# Altium project Scales.PrjPcb
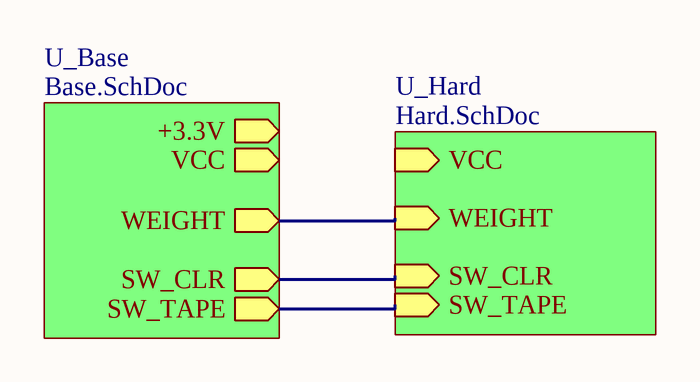
[diagram p0: MainScales.SchDoc]
4 sheets, 113 parts. Net scope: hierarchical (ports join the sheet entries above them; power ports are global).
Board file: Scales.PcbDoc
Sheets:
  MainScales.SchDoc
    U_Base = Base.SchDoc
    U_Hard = Hard.SchDoc
  Soft.SchDoc

## Sheet MainScales.SchDoc
size 297 x 209 mm; SheetNumber: 2; SheetTotal: 3

### Sub-sheets
U_Base = Base.SchDoc: SW_TAPE (out), SW_CLR (out), +3.3V (out), WEIGHT (out), VCC (out)
U_Hard = Hard.SchDoc: WEIGHT (in), VCC (in), SW_CLR (in), SW_TAPE (in)

### Nets
VCC: sheet U_Base/VCC, sheet U_Hard/VCC
NetC16_2: sheet U_Base/SW_TAPE, sheet U_Hard/SW_TAPE
NetD5_10: sheet U_Base/SW_CLR, sheet U_Hard/SW_CLR
NetD13_6: sheet U_Base/WEIGHT, sheet U_Hard/WEIGHT

### Notes on the sheet
- Author
- Manufacturer
- Date
- Page
- Total pages
- Size page
- A4
- Materials

## Sheet Base.SchDoc
size 420 x 297 mm; SheetNumber: 2; SheetTotal: 4
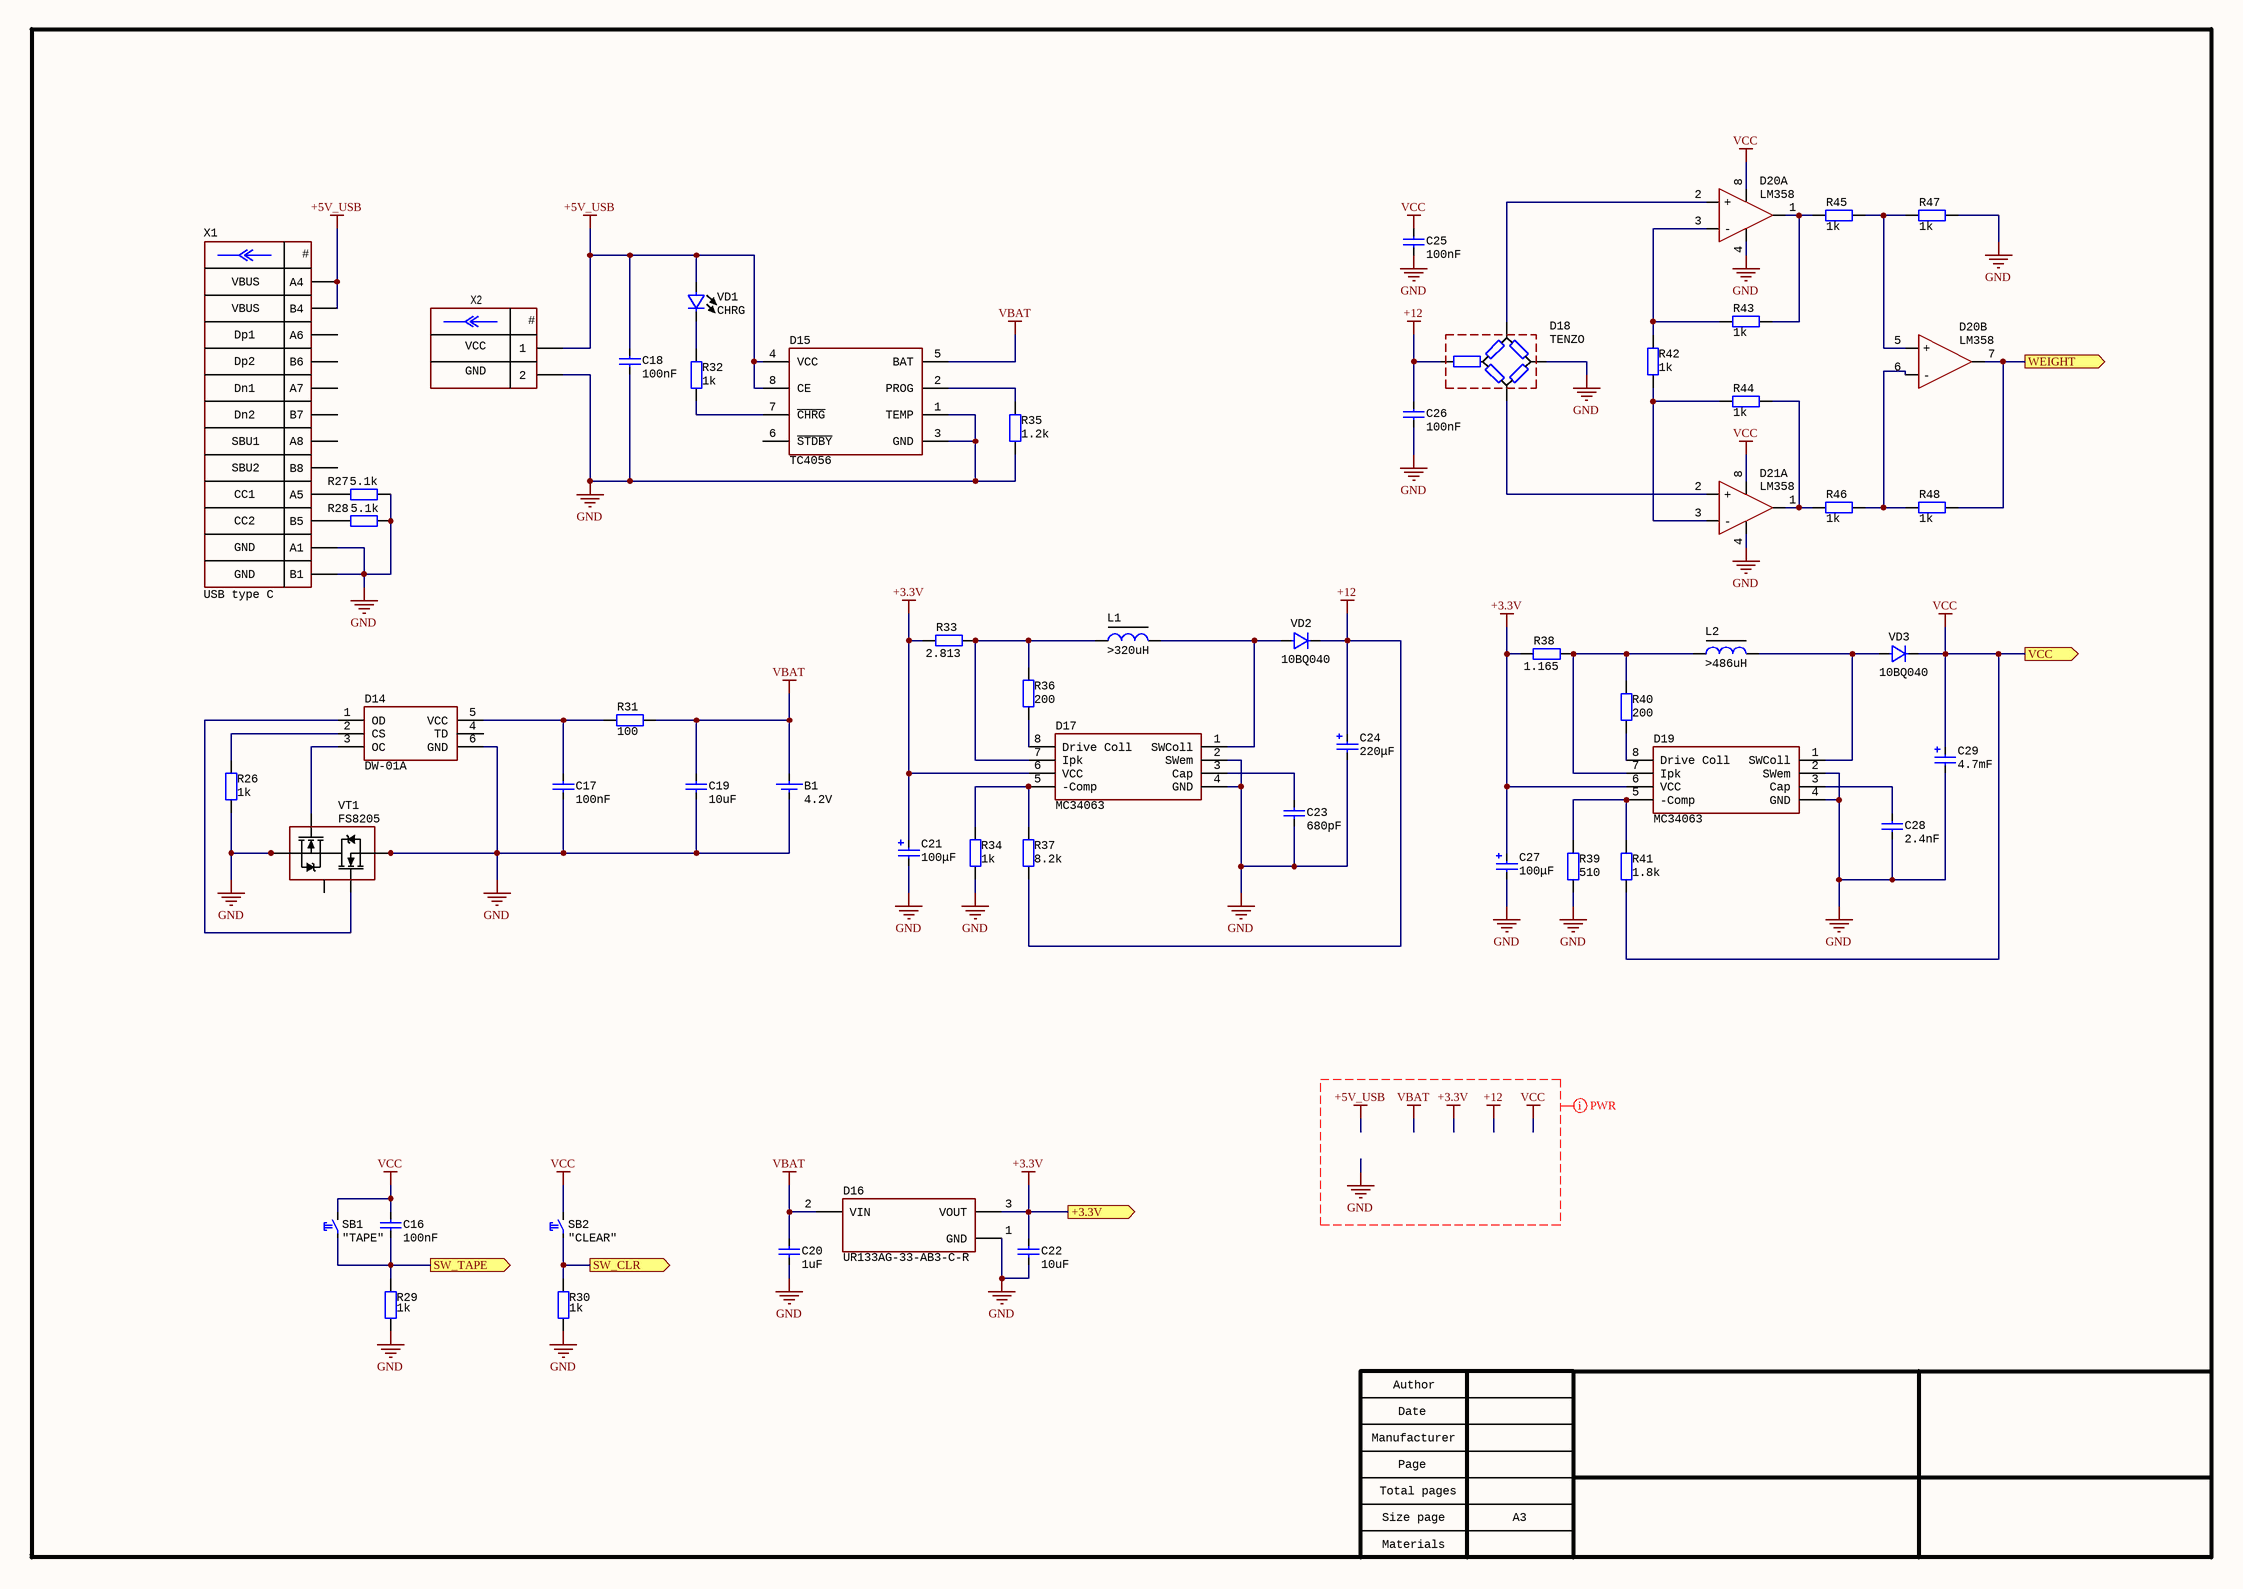
[diagram p1: Base.SchDoc]

### Parts
B1  VoltageMax: 4.2V  [CON: PLS-2]
C16  value 100nF  [CAP: ECHU(X) K (0603)]
C17  value 100nF  [CAP: ECHU(X) K (0603)]
C18  value 100nF  [CAP: ECHU(X) K (0603)]
C19  value 10uF  [CAP: ECHU(X) K (0603)]
C20  value 1uF  [CAP: ECHU(X) K (0603)]
C21  value 100μF  [CAP: TANTAL-E]
C22  value 10uF  [CAP: ECHU(X) K (0603)]
C23  value 680pF  [CAP: ECHU(X) J (0805)]
C24  value 220μF  [CAP: TANTAL-E]
C25  value 100nF  [CAP: ECHU(X) K (0603)]
C26  value 100nF  [CAP: ECHU(X) K (0603)]
C27  value 100μF  [CAP: TANTAL-E]
C28  value 2.4nF  [CAP: ECHU(X) J (0805)]
C29  value 4.7mF  [CAP: TANTAL-E]
D14  DW-01A  [SOT23-6]
D15  TC4056  [8-SOIC]
D16  (no value)  [SOT-89]
D17  (no value)  [8-SOIC]
D18  TENZO  [CON: PLS-4]
D19  (no value)  [8-SOIC]
D20  LM358  [8-SOIC]  (parts A,B of 2)
D21  LM358  [8-SOIC]  (part A of 2)
L1  Voltage: >320uH  [LQH55]
L2  Voltage: >486uH  [LQH55]
R26  value 1k  [RES: 0402]
R27  value 5.1k  [RES: 0402]
R28  value 5.1k  [RES: 0402]
R29  value 1k  [RES: 0402]
R30  value 1k  [RES: 0402]
R31  value 100  [RES: 0402]
R32  value 1k  [RES: 0402]
R33  value 2.813  [RES: 0402]
R34  value 1k  [RES: 0402]
R35  value 1.2k  [RES: 0402]
R36  value 200  [RES: 0402]
R37  value 8.2k  [RES: 0402]
R38  value 1.165  [RES: 0402]
R39  value 510  [RES: 0402]
R40  value 200  [RES: 0402]
R41  value 1.8k  [RES: 0402]
R42  value 1k  [RES: 0402]
R43  value 1k  [RES: 0402]
R44  value 1k  [RES: 0402]
R45  value 1k  [RES: 0402]
R46  value 1k  [RES: 0402]
R47  value 1k  [RES: 0402]
R48  value 1k  [RES: 0402]
SB1  CommentText: "TAPE"  [BUT: 6x3.5 SMD]
SB2  CommentText: "CLEAR"  [BUT: 6x3.5 SMD]
VD1  Color: CHRG  [LED: 0402B]
VD2  PartNumber: 10BQ040  [DIODE: SMB]
VD3  PartNumber: 10BQ040  [DIODE: SMB]
VT1  (no value)  [8-TSOP]
X1  CommentText: USB type C  [CON: TYPE-C-31-M-12]
X2  (no value)  [CON: PLS-2]

### Ports
+3.3V (out), SW_CLR (out), SW_TAPE (out), VCC (out), WEIGHT (out)

### Nets
+3.3V: C21.1 C22.2 C27.1 D16.3(VOUT) D17.6(VCC) D19.6(VCC) R33.1 R38.1 ; port +3.3V
+5V_USB: C18.2 D15.4(VCC) D15.8(CE) VD1.1 X1.A4 X1.B4 X2.1
+12: C24.1 C26.2 D18.1 R37.2 VD2.2
GND: B1.2(-) C17.1 C18.1 C19.2 C20.1 C21.2 C22.1 C23.1 C24.2 C25.1 C26.1 C27.2 C28.1 C29.2 D14.6(GND) D15.1(TEMP) D15.3(GND) D16.1(GND) D17.2(SWem) D17.4(GND) D18.4 D19.2(SWem) D19.4(GND) D20.4 D21.4 R26.2 R27.2 R28.2 R29.1 R30.1 R34.2 R35.2 R39.2 R47.1 VT1.2(S1) VT1.3(S1) VT1.6(S2) VT1.7(S2) X1.A1 X1.B1 X2.2
VBAT: B1.1(+) C19.1 C20.2 D15.5(BAT) D16.2(VIN) R31.2
VCC: C16.1 C25.2 C29.1 D20.8 D21.8 R41.2 SB1.2 SB2.2 VD3.2 ; port VCC
NetC16_2: C16.2 R29.2 SB1.1 ; port SW_TAPE
NetC17_2: C17.2 D14.5(VCC) R31.1
NetC23_2: C23.2 D17.3(Cap)
NetC28_2: C28.2 D19.3(Cap)
NetD5_10: R30.2 SB2.1 ; port SW_CLR
NetD13_6: D20.7 R48.1 ; port WEIGHT
NetD14_1: D14.1(OD) VT1.5(G2)
NetD14_2: D14.2(CS) R26.1
NetD14_3: D14.3(OC) VT1.4(G1)
NetD15_2: D15.2(PROG) R35.1
NetD15_7: D15.7(~{CHRG}) R32.2
NetD17_1: D17.1(SWColl) L1.1 VD2.1
NetD17_5: D17.5(-Comp) R34.1 R37.1
NetD17_7: D17.7(Ipk) L1.2 R33.2 R36.1
NetD17_8: D17.8(Drive_Coll) R36.2
NetD18_2: D18.2 D20.2(+)
NetD18_3: D18.3 D21.2(+)
NetD19_1: D19.1(SWColl) L2.1 VD3.1
NetD19_5: D19.5(-Comp) R39.1 R41.1
NetD19_7: D19.7(Ipk) L2.2 R38.2 R40.1
NetD19_8: D19.8(Drive_Coll) R40.2
NetD20_1: D20.1 R43.2 R45.2
NetD20_3: D20.3(-) R42.1 R43.1
NetD20_5: D20.5(+) R45.1 R47.2
NetD20_6: D20.6(-) R46.1 R48.2
NetD21_1: D21.1 R44.2 R46.2
NetD21_3: D21.3(-) R42.2 R44.1
NetR27_1: R27.1 X1.A5
NetR28_1: R28.1 X1.B5
NetR32_1: R32.1 VD1.2
NetVT1_1: VT1.1(D12) VT1.8(D12)

Not connected (* = marked no-connect by the designer): D14 4(TD); D15 6(~{STDBY}); X1 A6 A7 A8 B6 B7 B8

### Layout directives
net class PWR: +3.3V, +5V_USB, +12, GND, VBAT, VCC

### Notes on the sheet
- VCC
- (near X2) GND
- Author
- Manufacturer
- Date
- Page
- Total pages
- Size page
- A3
- Materials
- (in symbol Connector_USB_Type_C) #; VBUS; Dp1; Dp2; Dn1; Dn2; SBU1; SBU2; CC1; CC2; GND
- (in symbol PLS-2) #

### Library data of the parts
B1 = Battery PLS-2: Manufacturer: ALLOYSEED; ValueManufacturerPartNumber: Single holder 18650, 4.2V; PartNumber: Holder 18650; TypeConnector: Single holder 18650; HelpURL: https://ru.aliexpress.com/item/32814062027.html?spm=2114.13010708.0.0.498333edwmS6ak
C16-C18 C25 C26 = Film: Manufacturer: Epcos; PartNumber: B32774D4106K000; ValueManufacturerPartNumber: Film capacitor, 100nF, 15VDC, ±10%, 10.9mOhm, 31.5x15 mm, -40...+105°C; TypeCapacitor: Film capacitor; Tolerance: ±10%; Impedance: 10.9mOhm; Voltage: 15VDC; Package: 31.5x15 mm; HelpURL: https://www.digikey.com/products/en/capacitors/film-capacitors/62?k=&pkeyword=&sv=0&pv2097=1958&sf=0&FV=fffc01ef%2C1f140000%2Cffe0003e%2Cffec6366&quantity=1&ColumnSort=1000011&page=1&stock=1&pageSize=25; Temperature: -40...+105°C
C19 C22 = Film: Manufacturer: Epcos; PartNumber: B32774D4106K000; ValueManufacturerPartNumber: Film capacitor, 10uF, 15VDC, ±10%, 10.9mOhm, 31.5x15 mm, -40...+105°C; TypeCapacitor: Film capacitor; Tolerance: ±10%; Impedance: 10.9mOhm; Voltage: 15VDC; Package: 31.5x15 mm; HelpURL: https://www.digikey.com/products/en/capacitors/film-capacitors/62?k=&pkeyword=&sv=0&pv2097=1958&sf=0&FV=fffc01ef%2C1f140000%2Cffe0003e%2Cffec6366&quantity=1&ColumnSort=1000011&page=1&stock=1&pageSize=25; Temperature: -40...+105°C
C20 = Film: Manufacturer: Epcos; PartNumber: B32774D4106K000; ValueManufacturerPartNumber: Film capacitor, 1uF, 15VDC, ±10%, 10.9mOhm, 31.5x15 mm, -40...+105°C; TypeCapacitor: Film capacitor; Tolerance: ±10%; Impedance: 10.9mOhm; Voltage: 15VDC; Package: 31.5x15 mm; HelpURL: https://www.digikey.com/products/en/capacitors/film-capacitors/62?k=&pkeyword=&sv=0&pv2097=1958&sf=0&FV=fffc01ef%2C1f140000%2Cffe0003e%2Cffec6366&quantity=1&ColumnSort=1000011&page=1&stock=1&pageSize=25; Temperature: -40...+105°C
C21 C27 = Tantal: Manufacturer: AVX; PartNumber: F930J107KAAAJ6; ValueManufacturerPartNumber: Tantalum capacitor, 100μF, 6.3V, ±10%, 2Ohm, case A (3216), -55...+125°C; Impedance: 2Ohm; Tolerance: ±10%; TypeDielectric: X7R; TypeCapacitor: Tantalum capacitor; Voltage: 6.3V; Package: case A (3216); HelpURL: https://www.digikey.com/product-detail/en/avx-corporation/F930J107KAAAJ6/478-12404-1-ND/9645231; Temperature: -55...+125°C
C23 = Film: Manufacturer: Epcos; PartNumber: B32774D4106K000; ValueManufacturerPartNumber: Film capacitor, 680pF, 15VDC, ±10%, 10.9mOhm, 31.5x15 mm, -40...+105°C; TypeCapacitor: Film capacitor; Tolerance: ±10%; Impedance: 10.9mOhm; Voltage: 15VDC; Package: 31.5x15 mm; HelpURL: https://www.digikey.com/products/en/capacitors/film-capacitors/62?k=&pkeyword=&sv=0&pv2097=1958&sf=0&FV=fffc01ef%2C1f140000%2Cffe0003e%2Cffec6366&quantity=1&ColumnSort=1000011&page=1&stock=1&pageSize=25; Temperature: -40...+105°C
C24 = Tantal: Manufacturer: AVX; PartNumber: F930J107KAAAJ6; ValueManufacturerPartNumber: Tantalum capacitor, 220μF, 6.3V, ±10%, 2Ohm, case A (3216), -55...+125°C; Impedance: 2Ohm; Tolerance: ±10%; TypeDielectric: X7R; TypeCapacitor: Tantalum capacitor; Voltage: 6.3V; Package: case A (3216); HelpURL: https://www.digikey.com/product-detail/en/avx-corporation/F930J107KAAAJ6/478-12404-1-ND/9645231; Temperature: -55...+125°C
C28 = Film: Manufacturer: Epcos; PartNumber: B32774D4106K000; ValueManufacturerPartNumber: Film capacitor, 2.4nF, 15VDC, ±10%, 10.9mOhm, 31.5x15 mm, -40...+105°C; TypeCapacitor: Film capacitor; Tolerance: ±10%; Impedance: 10.9mOhm; Voltage: 15VDC; Package: 31.5x15 mm; HelpURL: https://www.digikey.com/products/en/capacitors/film-capacitors/62?k=&pkeyword=&sv=0&pv2097=1958&sf=0&FV=fffc01ef%2C1f140000%2Cffe0003e%2Cffec6366&quantity=1&ColumnSort=1000011&page=1&stock=1&pageSize=25; Temperature: -40...+105°C
C29 = Tantal: Manufacturer: AVX; PartNumber: F930J107KAAAJ6; ValueManufacturerPartNumber: Tantalum capacitor, 4.7mF, 6.3V, ±10%, 2Ohm, case A (3216), -55...+125°C; Impedance: 2Ohm; Tolerance: ±10%; TypeDielectric: X7R; TypeCapacitor: Tantalum capacitor; Voltage: 6.3V; Package: case A (3216); HelpURL: https://www.digikey.com/product-detail/en/avx-corporation/F930J107KAAAJ6/478-12404-1-ND/9645231; Temperature: -55...+125°C
D14 = DW-01A: No Charging Interruption Due to Input Voltage Fluctuation, 4.5 to 6.5 V Vin, 8-pin SOT23 (TS8-8), -40 to 85 degC, Pb-Free, Mini Tape and Reel; PartNumber: LTC4056ETS8-4.2#TRMPBF; Manufacturer: Linear Technology; Max Charge Current(A): 0.7; Vin Max(V): 6.5; Battery Chemistry: Li-Ion, Li-Polymer; Number of Cells: 1; Charge Termination: On-board timer; Float Voltage: 4.2 V; Type of Charger: Linear; Vin Min(V): 4.5; Mounting Technology: Surface Mount; PackageVersion: Rev. A, 08/2010; ComponentLink3Description: Package Specification; Packing: Mini Tape and Reel; PackageReference: TS8-8; ComponentLink2URL: http://cds.linear.com/docs/en/datasheet/405642f.pdf; PackageDescription: 8-Pin Plastic TSOT-23, Body 2.9 x 1.63 mm, Pitch 0.65 mm; ComponentLink2Description: Datasheet; Code_JEDEC: MO-193; ComponentLink3URL: http://cds.linear.com/docs/en/packaging/SOT_8_05-08-1637.pdf; ComponentLink1Description: Manufacturer URL; ComponentLink1URL: http://www.linear.com/; RoHS: TRUE
D15 = TC4056: No Charging Interruption Due to Input Voltage Fluctuation, 4.5 to 6.5 V Vin, 8-pin SOT23 (TS8-8), -40 to 85 degC, Pb-Free, Mini Tape and Reel; PartNumber: LTC4056ETS8-4.2#TRMPBF; Manufacturer: Linear Technology; Max Charge Current(A): 0.7; Vin Max(V): 6.5; Battery Chemistry: Li-Ion, Li-Polymer; Number of Cells: 1; Charge Termination: On-board timer; Float Voltage: 4.2 V; Type of Charger: Linear; Vin Min(V): 4.5; Mounting Technology: Surface Mount; PackageVersion: Rev. A, 08/2010; ComponentLink3Description: Package Specification; Packing: Mini Tape and Reel; PackageReference: TS8-8; ComponentLink2URL: http://cds.linear.com/docs/en/datasheet/405642f.pdf; PackageDescription: 8-Pin Plastic TSOT-23, Body 2.9 x 1.63 mm, Pitch 0.65 mm; ComponentLink2Description: Datasheet; Code_JEDEC: MO-193; ComponentLink3URL: http://cds.linear.com/docs/en/packaging/SOT_8_05-08-1637.pdf; ComponentLink1Description: Manufacturer URL; ComponentLink1URL: http://www.linear.com/; RoHS: TRUE
D16 = UR133AG-33-AB3-C-R: Linear voltage regulator; Manufacturer: Diodes Incorporated; ValueManufacturerPartNumber: Linear voltage regulator, input 2.5...6V, 0.7V, output 1.8V, 0.3A, -40...+85°C, SOT23-5; VoltageInput: input 2.5...6V; MaxDropout: 0.7V; CurrentOutput: 0.3A; VoltageOutput: output 1.8V; HelpURL: https://www.digikey.com/en/products/detail/diodes-incorporated/AP2127K-1-8TRG1/4470784; Package: SOT23-5; ComponentType: Linear voltage regulator; Temperature: -40...+85°C; PartNumber: UR133AG-33-AB3-C-R
D17 D19 = MC34063: DC/DC; Manufacturer: Diodes Incorporated; ValueManufacturerPartNumber: DC/DC boost converter, input 2.6...16V, 1.5MHz, output 3...29V, 0.5A, -40...+85°C, SOT23-5; VoltageInput: input 2.6...16V; Frequency: 1.5MHz; CurrentOutput: 0.5A; VoltageOutput: output 3...29V; HelpURL: https://www.digikey.com/product-detail/en/diodes-incorporated/AP3012KTR-G1/AP3012KTR-G1DICT-ND/4505297; Package: SOT23-5; ComponentType: DC/DC boost converter; Temperature: -40...+85°C; PartNumber: MC34063
D20 D21 = LM358: Comparator; Manufacturer: Microchip Technology; ValueManufacturerPartNumber: IC comparator, Rail-to-Rail, 1.6...5.5V, -40...+85°C, SOT23-5; Supply: 1.6...5.5V; OutputType: Rail-to-Rail; HelpURL: https://www.digikey.com/product-detail/en/microchip-technology/MCP6541T-I-OT/MCP6541T-I-OTCT-ND/3622387; Package: SOT23-5; ComponentType: IC comparator; Temperature: -40...+85°C
L1 = Current_CT1005A: Manufacturer: Asia; ValueManufacturerPartNumber: Transformer, >320uH, 0...250 Ohm; PartNumber: DL-CT1005A; TypeTransformer: Transformer; Power: 0...250 Ohm; HelpURL: https://ru.aliexpress.com/item/32848841435.html?spm=a2g0v.search0104.3.2.64104769Wp7Ww8&ws_ab_test=searchweb0_0%2Csearchweb201602_10_10065_10068_319_317_10696_453_10084_454_10083_10618_10307_10301_537_536_10059_10884_10887_321_322_10915_10103_10914_10911_10910%2Csearchweb201603_52%2CppcSwitch_0&algo_expid=7e4b162f-38ca-419c-8891-4e3cfaf6b6a7-0&algo_pvid=7e4b162f-38ca-419c-8891-4e3cfaf6b6a7&transAbTest=ae803_5
L2 = Current_CT1005A: Manufacturer: Asia; ValueManufacturerPartNumber: Transformer, >486uH, 0...250 Ohm; PartNumber: DL-CT1005A; TypeTransformer: Transformer; Power: 0...250 Ohm; HelpURL: https://ru.aliexpress.com/item/32848841435.html?spm=a2g0v.search0104.3.2.64104769Wp7Ww8&ws_ab_test=searchweb0_0%2Csearchweb201602_10_10065_10068_319_317_10696_453_10084_454_10083_10618_10307_10301_537_536_10059_10884_10887_321_322_10915_10103_10914_10911_10910%2Csearchweb201603_52%2CppcSwitch_0&algo_expid=7e4b162f-38ca-419c-8891-4e3cfaf6b6a7-0&algo_pvid=7e4b162f-38ca-419c-8891-4e3cfaf6b6a7&transAbTest=ae803_5
R26 R29 R30 R32 R34 R42-R48 = Resistor_2: Manufacturer: Yageo; PartNumber: RC0201JR-07100RL; ValueManufacturerPartNumber: Resistor film, 1k, ±5%, 0201, 0.05W, -55...+125°C; TypeResistor: Resistor film; Power: 0.05W; Tolerance: ±5%; Package: 0201; HelpURL: https://www.digikey.com/product-detail/en/yageo/RC0201JR-07100RL/311-100NCT-ND/1949006; Temperature: -55...+125°C
R27 R28 = Resistor_2: Manufacturer: Yageo; PartNumber: RC0201JR-07100RL; ValueManufacturerPartNumber: Resistor film, 5.1k, ±5%, 0201, 0.05W, -55...+125°C; TypeResistor: Resistor film; Power: 0.05W; Tolerance: ±5%; Package: 0201; HelpURL: https://www.digikey.com/product-detail/en/yageo/RC0201JR-07100RL/311-100NCT-ND/1949006; Temperature: -55...+125°C
R31 = Resistor_2: Manufacturer: Yageo; PartNumber: RC0201JR-07100RL; ValueManufacturerPartNumber: Resistor film, 100, ±5%, 0201, 0.05W, -55...+125°C; TypeResistor: Resistor film; Power: 0.05W; Tolerance: ±5%; Package: 0201; HelpURL: https://www.digikey.com/product-detail/en/yageo/RC0201JR-07100RL/311-100NCT-ND/1949006; Temperature: -55...+125°C
R33 = Resistor_2: Manufacturer: Yageo; PartNumber: RC0201JR-07100RL; ValueManufacturerPartNumber: Resistor film, 2.813, ±5%, 0201, 0.05W, -55...+125°C; TypeResistor: Resistor film; Power: 0.05W; Tolerance: ±5%; Package: 0201; HelpURL: https://www.digikey.com/product-detail/en/yageo/RC0201JR-07100RL/311-100NCT-ND/1949006; Temperature: -55...+125°C
R35 = Resistor_2: Manufacturer: Yageo; PartNumber: RC0201JR-07100RL; ValueManufacturerPartNumber: Resistor film, 1.2k, ±5%, 0201, 0.05W, -55...+125°C; TypeResistor: Resistor film; Power: 0.05W; Tolerance: ±5%; Package: 0201; HelpURL: https://www.digikey.com/product-detail/en/yageo/RC0201JR-07100RL/311-100NCT-ND/1949006; Temperature: -55...+125°C
R36 R40 = Resistor_2: Manufacturer: Yageo; PartNumber: RC0201JR-07100RL; ValueManufacturerPartNumber: Resistor film, 200, ±5%, 0201, 0.05W, -55...+125°C; TypeResistor: Resistor film; Power: 0.05W; Tolerance: ±5%; Package: 0201; HelpURL: https://www.digikey.com/product-detail/en/yageo/RC0201JR-07100RL/311-100NCT-ND/1949006; Temperature: -55...+125°C
R37 = Resistor_2: Manufacturer: Yageo; PartNumber: RC0201JR-07100RL; ValueManufacturerPartNumber: Resistor film, 8.2k, ±5%, 0201, 0.05W, -55...+125°C; TypeResistor: Resistor film; Power: 0.05W; Tolerance: ±5%; Package: 0201; HelpURL: https://www.digikey.com/product-detail/en/yageo/RC0201JR-07100RL/311-100NCT-ND/1949006; Temperature: -55...+125°C
R38 = Resistor_2: Manufacturer: Yageo; PartNumber: RC0201JR-07100RL; ValueManufacturerPartNumber: Resistor film, 1.165, ±5%, 0201, 0.05W, -55...+125°C; TypeResistor: Resistor film; Power: 0.05W; Tolerance: ±5%; Package: 0201; HelpURL: https://www.digikey.com/product-detail/en/yageo/RC0201JR-07100RL/311-100NCT-ND/1949006; Temperature: -55...+125°C
R39 = Resistor_2: Manufacturer: Yageo; PartNumber: RC0201JR-07100RL; ValueManufacturerPartNumber: Resistor film, 510, ±5%, 0201, 0.05W, -55...+125°C; TypeResistor: Resistor film; Power: 0.05W; Tolerance: ±5%; Package: 0201; HelpURL: https://www.digikey.com/product-detail/en/yageo/RC0201JR-07100RL/311-100NCT-ND/1949006; Temperature: -55...+125°C
R41 = Resistor_2: Manufacturer: Yageo; PartNumber: RC0201JR-07100RL; ValueManufacturerPartNumber: Resistor film, 1.8k, ±5%, 0201, 0.05W, -55...+125°C; TypeResistor: Resistor film; Power: 0.05W; Tolerance: ±5%; Package: 0201; HelpURL: https://www.digikey.com/product-detail/en/yageo/RC0201JR-07100RL/311-100NCT-ND/1949006; Temperature: -55...+125°C
SB1 SB2 = Button_tactile: Manufacturer: TE Connectivity; ValueManufacturerPartNumber: Tactile button, 6x6mm; PartNumber: FSM2JSMAATR; TypeButton: Tactile button; HelpURL: https://www.digikey.com/product-detail/en/te-connectivity-alcoswitch-switches/FSM2JSMAATR/450-1792-1-ND/3503931; Package: 6x6mm
VD1 = LED_single: ValueManufacturerPartNumber: LED, Green, *, *, *, -55...+150°C; TypeDiode: LED; ColorParameter: Green; Manufacturer: *; Package: *; HelpURL: *; Temperature: -55...+150°C; Current: *; VoltageDrop: *; PartNumber: *
VD2 VD3 = Diode_single: Manufacturer: Micro Commercial; ValueManufacturerPartNumber: Single diode, 75V, 150mA, 1V, 4ns, SOD-323, -55...+150°C; TypeDiode: Single diode; Voltage: 75V; Current: 150mA; VoltageDrop: 1V; RecoveryTime: 4ns; Package: SOD-323; HelpURL: https://www.digikey.com/product-detail/en/micro-commercial-co/1N4148WX-TP/1N4148WXTPMSCT-ND/717312; Temperature: -55...+150°C
VT1 = FS8205: Manufacturer: Infineon Technologies; ValueManufacturerPartNumber: MOSFET N-channel transistor, 80V, 7A, 9.1nC, 2.5W, 34mOhm, 756pF, 8-TDSON, -55...+150°C; TypeTransistor: MOSFET N-channel transistor; VoltageDS: 80V; CurrentDS: 7A; RDS: 34mOhm; GateCharge: 9.1nC; InputCapacitor: 756pF; MaxPower: 2.5W; Package: 8-TDSON; HelpURL: https://www.digikey.com/product-detail/en/infineon-technologies/BSC340N08NS3GATMA1/BSC340N08NS3GATMA1TR-ND/2080655; Temperature: -55...+150°C; PartNumber: FS8205
X1 = Connector_USB_Type_C: Manufacturer: Korean Hroparts; ValueManufacturerPartNumber: USB Type C, 3A; PartNumber: TYPE-C-31-M-12; CurrentMax: 3A; HelpURL: https://lcsc.com/product-detail/USB-Type-C_Korean-Hroparts-Elec-TYPE-C-31-M-12_C165948.html; TypeConnector: USB Type C
X2 = PLS-2: Manufacturer: Connfly; ValueManufacturerPartNumber: Connector, 2pin, 2.54mm, 500VAC, 3A; TypeConnector: Connector; VoltageMax: 500VAC; Pitch: 2.54mm; CurrentMax: 3A; Multichannel: 2pin; CommentText: "Разъем"; HelpURL: https://www.chipdip.ru/product/pls-2; PartNumber: PLS-2

## Sheet Hard.SchDoc
size 420 x 297 mm; SheetNumber: 2; SheetTotal: 3
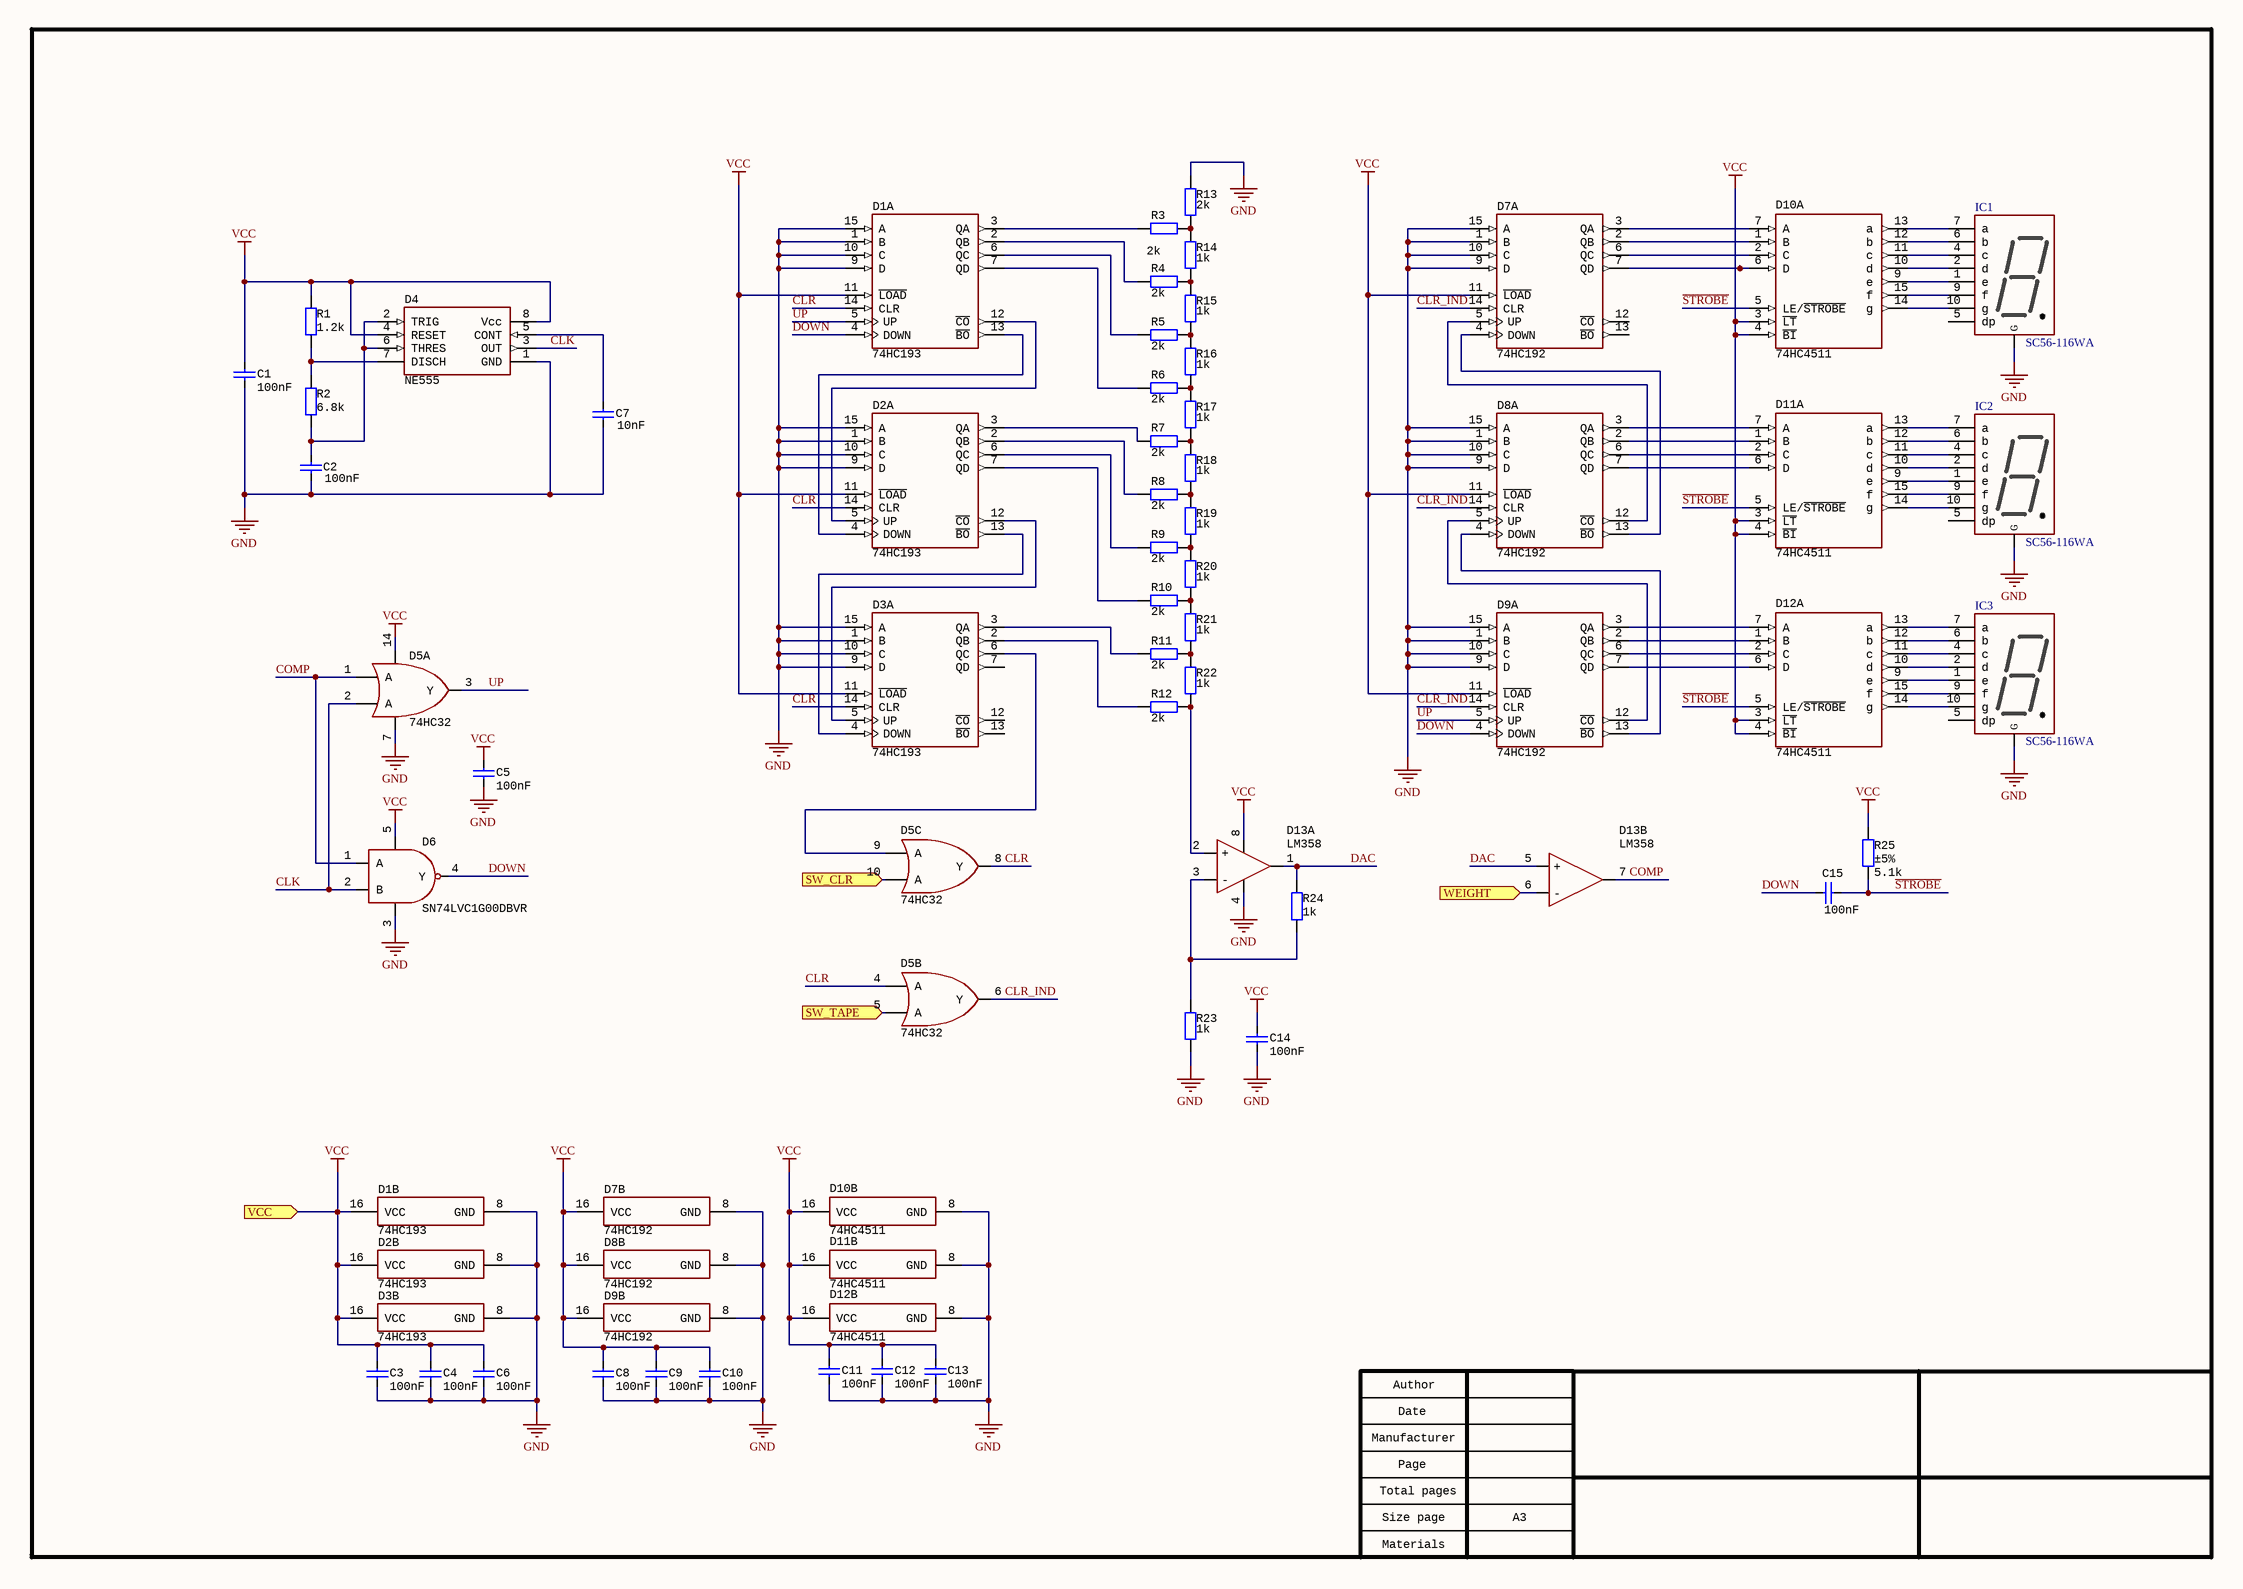
[diagram p2: Hard.SchDoc]

### Parts
C1  value 100nF  [CAP: ECHU(X) K (0603)]
C2  value 100nF  [CAP: ECHU(X) K (0603)]
C3  value 100nF  [CAP: ECHU(X) K (0603)]
C4  value 100nF  [CAP: ECHU(X) K (0603)]
C5  value 100nF  [CAP: ECHU(X) K (0603)]
C6  value 100nF  [CAP: ECHU(X) K (0603)]
C7  value 10nF  [CAP: ECHU(X) K (0603)]
C8  value 100nF  [CAP: ECHU(X) K (0603)]
C9  value 100nF  [CAP: ECHU(X) K (0603)]
C10  value 100nF  [CAP: ECHU(X) K (0603)]
C11  value 100nF  [CAP: ECHU(X) K (0603)]
C12  value 100nF  [CAP: ECHU(X) K (0603)]
C13  value 100nF  [CAP: ECHU(X) K (0603)]
C14  value 100nF  [CAP: ECHU(X) K (0603)]
C15  value 100nF  [CAP: ECHU(X) K (0603)]
D1  74HC193  [16-SO]  (parts A,B of 2)
D2  74HC193  [16-SO]  (parts A,B of 2)
D3  74HC193  [16-SO]  (parts A,B of 2)
D4  NE555  [8-SOIC]
D5  (no value)  [14-SOIC]  (parts A,B,C of 4)
D6  (no value)  [SOT23-5]
D7  74HC192  [16-SO]  (parts A,B of 2)
D8  74HC192  [16-SO]  (parts A,B of 2)
D9  74HC192  [16-SO]  (parts A,B of 2)
D10  74HC4511  [16-SO]  (parts A,B of 2)
D11  74HC4511  [16-SO]  (parts A,B of 2)
D12  74HC4511  [16-SO]  (parts A,B of 2)
D13  LM358  [8-SOIC]  (parts A,B of 2)
IC1  SC56-116WA  [SC56-116WA]
IC2  SC56-116WA  [SC56-116WA]
IC3  SC56-116WA  [SC56-116WA]
R1  value 1.2k  [RES: 0402]
R2  value 6.8k  [RES: 0402]
R3  value 2k  [RES: 0402]
R4  value 2k  [RES: 0402]
R5  value 2k  [RES: 0402]
R6  value 2k  [RES: 0402]
R7  value 2k  [RES: 0402]
R8  value 2k  [RES: 0402]
R9  value 2k  [RES: 0402]
R10  value 2k  [RES: 0402]
R11  value 2k  [RES: 0402]
R12  value 2k  [RES: 0402]
R13  value 2k  [RES: 0402]
R14  value 1k  [RES: 0402]
R15  value 1k  [RES: 0402]
R16  value 1k  [RES: 0402]
R17  value 1k  [RES: 0402]
R18  value 1k  [RES: 0402]
R19  value 1k  [RES: 0402]
R20  value 1k  [RES: 0402]
R21  value 1k  [RES: 0402]
R22  value 1k  [RES: 0402]
R23  value 1k  [RES: 0402]
R24  value 1k  [RES: 0402]
R25  value 5.1k  Tolerance: ±5%  [RES: 0402]

### Ports
SW_CLR (in), SW_TAPE (in), VCC (in), WEIGHT (in)

### Nets
GND: C1.1 C2.1 C3.1 C4.1 C5.1 C6.1 C7.1 C8.1 C9.1 C10.1 C11.1 C12.1 C13.1 C14.1 D1.1(B) D1.8(GND) D1.9(D) D1.10(C) D1.15(A) D2.1(B) D2.8(GND) D2.9(D) D2.10(C) D2.15(A) D3.1(B) D3.8(GND) D3.9(D) D3.10(C) D3.15(A) D4.1(GND) D5.7 D6.3 D7.1(B) D7.8(GND) D7.9(D) D7.10(C) D7.15(A) D8.1(B) D8.8(GND) D8.9(D) D8.10(C) D8.15(A) D9.1(B) D9.8(GND) D9.9(D) D9.10(C) D9.15(A) D10.8(GND) D11.8(GND) D12.8(GND) D13.4 IC1.G IC2.G IC3.G R13.2 R23.1
VCC: C1.2 C3.2 C4.2 C5.2 C6.2 C8.2 C9.2 C10.2 C11.2 C12.2 C13.2 C14.2 D1.11(~{LOAD}) D1.16(VCC) D2.11(~{LOAD}) D2.16(VCC) D3.11(~{LOAD}) D3.16(VCC) D4.4(RESET) D4.8(Vcc) D5.14 D6.5 D7.11(~{LOAD}) D7.16(VCC) D8.11(~{LOAD}) D8.16(VCC) D9.11(~{LOAD}) D9.16(VCC) D10.3(~{LT}) D10.4(~{BI}) D10.16(VCC) D11.3(~{LT}) D11.4(~{BI}) D11.16(VCC) D12.3(~{LT}) D12.4(~{BI}) D12.16(VCC) D13.8 R1.1 R25.2 ; port VCC
CLK: D4.3(OUT) D5.2(A) D6.2(B)
CLR: D1.14(CLR) D2.14(CLR) D3.14(CLR) D5.4(A) D5.8(Y)
CLR_IND: D5.6(Y) D7.14(CLR) D8.14(CLR) D9.14(CLR)
COMP: D5.1(A) D6.1(A) D13.7
DAC: D13.1 D13.5(+) R24.1
DOWN: C15.1 D1.4(DOWN) D6.4(Y) D9.4(DOWN)
~{STROBE}: C15.2 D10.5(LE/~{STROBE}) D11.5(LE/~{STROBE}) D12.5(LE/~{STROBE}) R25.1
UP: D1.5(UP) D5.3(Y) D9.5(UP)
NetC2_2: C2.2 D4.2(TRIG) D4.6(THRES) R2.2
NetC7_2: C7.2 D4.5(CONT)
NetC16_2: D5.5(A) ; port SW_TAPE
NetD1_2: D1.2(QB) R4.2
NetD1_3: D1.3(QA) R3.2
NetD1_6: D1.6(QC) R5.2
NetD1_7: D1.7(QD) R6.2
NetD1_12: D1.12(~{CO}) D2.5(UP)
NetD1_13: D1.13(~{BO}) D2.4(DOWN)
NetD2_2: D2.2(QB) R8.2
NetD2_3: D2.3(QA) R7.2
NetD2_6: D2.6(QC) R9.2
NetD2_7: D2.7(QD) R10.2
NetD2_12: D2.12(~{CO}) D3.5(UP)
NetD2_13: D2.13(~{BO}) D3.4(DOWN)
NetD3_2: D3.2(QB) R12.2
NetD3_3: D3.3(QA) R11.2
NetD3_6: D3.6(QC) D5.9(A)
NetD4_7: D4.7(DISCH) R1.2 R2.1
NetD5_10: D5.10(A) ; port SW_CLR
NetD7_2: D7.2(QB) D10.1(B)
NetD7_3: D7.3(QA) D10.7(A)
NetD7_4: D7.4(DOWN) D8.13(~{BO})
NetD7_5: D7.5(UP) D8.12(~{CO})
NetD7_6: D7.6(QC) D10.2(C)
NetD7_7: D7.7(QD) D10.6(D)
NetD8_2: D8.2(QB) D11.1(B)
NetD8_3: D8.3(QA) D11.7(A)
NetD8_4: D8.4(DOWN) D9.13(~{BO})
NetD8_5: D8.5(UP) D9.12(~{CO})
NetD8_6: D8.6(QC) D11.2(C)
NetD8_7: D8.7(QD) D11.6(D)
NetD9_2: D9.2(QB) D12.1(B)
NetD9_3: D9.3(QA) D12.7(A)
NetD9_6: D9.6(QC) D12.2(C)
NetD9_7: D9.7(QD) D12.6(D)
NetD10_9: D10.9(e) IC1.1(e)
NetD10_10: D10.10(d) IC1.2(d)
NetD10_11: D10.11(c) IC1.4(c)
NetD10_12: D10.12(b) IC1.6(b)
NetD10_13: D10.13(a) IC1.7(a)
NetD10_14: D10.14(g) IC1.10(g)
NetD10_15: D10.15(f) IC1.9(f)
NetD11_9: D11.9(e) IC2.1(e)
NetD11_10: D11.10(d) IC2.2(d)
NetD11_11: D11.11(c) IC2.4(c)
NetD11_12: D11.12(b) IC2.6(b)
NetD11_13: D11.13(a) IC2.7(a)
NetD11_14: D11.14(g) IC2.10(g)
NetD11_15: D11.15(f) IC2.9(f)
NetD12_9: D12.9(e) IC3.1(e)
NetD12_10: D12.10(d) IC3.2(d)
NetD12_11: D12.11(c) IC3.4(c)
NetD12_12: D12.12(b) IC3.6(b)
NetD12_13: D12.13(a) IC3.7(a)
NetD12_14: D12.14(g) IC3.10(g)
NetD12_15: D12.15(f) IC3.9(f)
NetD13_2: D13.2(+) R12.1 R22.1
NetD13_3: D13.3(-) R23.2 R24.2
NetD13_6: D13.6(-) ; port WEIGHT
NetR3_1: R3.1 R13.1 R14.2
NetR4_1: R4.1 R14.1 R15.2
NetR5_1: R5.1 R15.1 R16.2
NetR6_1: R6.1 R16.1 R17.2
NetR7_1: R7.1 R17.1 R18.2
NetR8_1: R8.1 R18.1 R19.2
NetR9_1: R9.1 R19.1 R20.2
NetR10_1: R10.1 R20.1 R21.2
NetR11_1: R11.1 R21.1 R22.2

Not connected (* = marked no-connect by the designer): D3 7(QD) 12(~{CO}) 13(~{BO}); D7 12(~{CO}) 13(~{BO}); IC1 5(dp); IC2 5(dp); IC3 5(dp)

### Notes on the sheet
- Author
- Manufacturer
- Date
- Page
- Total pages
- Size page
- A3
- Materials

### Library data of the parts
C1-C6 C8-C15 = Film: as C16 on sheet Base; Package: 31.5x15 mm; HelpURL: https://www.digikey.com/products/en/capacitors/film-capacitors/62?k=&pkeyword=&sv=0&pv2097=1958&sf=0&FV=fffc01ef%2C1f140000%2Cffe0003e%2Cffec6366&quantity=1&ColumnSort=1000011&page=1&stock=1&pageSize=25; Temperature: -40...+105°C
C7 = Film: Manufacturer: Epcos; PartNumber: B32774D4106K000; ValueManufacturerPartNumber: Film capacitor, 10nF, 15VDC, ±10%, 10.9mOhm, 31.5x15 mm, -40...+105°C; TypeCapacitor: Film capacitor; Tolerance: ±10%; Impedance: 10.9mOhm; Voltage: 15VDC; Package: 31.5x15 mm; HelpURL: https://www.digikey.com/products/en/capacitors/film-capacitors/62?k=&pkeyword=&sv=0&pv2097=1958&sf=0&FV=fffc01ef%2C1f140000%2Cffe0003e%2Cffec6366&quantity=1&ColumnSort=1000011&page=1&stock=1&pageSize=25; Temperature: -40...+105°C
D1-D3 = 74HC193: Counter
D4 = NE555: Counter
D5 = 74HC32: OR; Manufacturer: Texas Instruments; ValueManufacturerPartNumber: IC logic OR, 1.65...5.5V, -40...+125°C, SOT23-6; Supply: 1.65...5.5V; HelpURL: https://www.digikey.com/product-detail/en/texas-instruments/SN74LVC1G332DBVR/296-18587-1-ND/857355; Package: SOT23-6; ComponentType: IC logic OR; Temperature: -40...+125°C; PartNumber: 74HC32
D6 = SN74LVC1G00DBVR: NAND; Manufacturer: Texas Instruments; ValueManufacturerPartNumber: IC logic AND, 1.65...5.5V, -40...+125°C, SC-70-5; Supply: 1.65...5.5V; HelpURL: https://ru.mouser.com/ProductDetail/Texas-Instruments/SN74LVC1G132DCKR?qs=nqigI8dpoHL8JNZWqteaEg%3D%3D; Package: SC-70-5; ComponentType: IC logic AND; Temperature: -40...+125°C; PartNumber: SN74LVC1G00DBVR
D7-D9 = 74HC192: Counter
D10-D12 = 74HC4511: 7-seg decoder
D13 = LM358: as D20 on sheet Base; HelpURL: https://www.digikey.com/product-detail/en/microchip-technology/MCP6541T-I-OT/MCP6541T-I-OTCT-ND/3622387; Package: SOT23-5; ComponentType: IC comparator; Temperature: -40...+85°C
R1 = Resistor_2: as R35 on sheet Base; Package: 0201; HelpURL: https://www.digikey.com/product-detail/en/yageo/RC0201JR-07100RL/311-100NCT-ND/1949006; Temperature: -55...+125°C
R2 = Resistor_2: Manufacturer: Yageo; PartNumber: RC0201JR-07100RL; ValueManufacturerPartNumber: Resistor film, 6.8k, ±5%, 0201, 0.05W, -55...+125°C; TypeResistor: Resistor film; Power: 0.05W; Tolerance: ±5%; Package: 0201; HelpURL: https://www.digikey.com/product-detail/en/yageo/RC0201JR-07100RL/311-100NCT-ND/1949006; Temperature: -55...+125°C
R3-R13 = Resistor_2: Manufacturer: Yageo; PartNumber: RC0201JR-07100RL; ValueManufacturerPartNumber: Resistor film, 2k, ±5%, 0201, 0.05W, -55...+125°C; TypeResistor: Resistor film; Power: 0.05W; Tolerance: ±5%; Package: 0201; HelpURL: https://www.digikey.com/product-detail/en/yageo/RC0201JR-07100RL/311-100NCT-ND/1949006; Temperature: -55...+125°C
R14-R24 = Resistor_2: as R26 on sheet Base; Package: 0201; HelpURL: https://www.digikey.com/product-detail/en/yageo/RC0201JR-07100RL/311-100NCT-ND/1949006; Temperature: -55...+125°C
R25 = Resistor_2: Manufacturer: Yageo; PartNumber: RC0201JR-07100RL; ValueManufacturerPartNumber: Resistor film, 5.1k, ±5%, 0201, 0.05W, -55...+125°C; TypeResistor: Resistor film; Power: 0.05W; Package: 0201; HelpURL: https://www.digikey.com/product-detail/en/yageo/RC0201JR-07100RL/311-100NCT-ND/1949006; Temperature: -55...+125°C

## Sheet Soft.SchDoc
size A4; SheetNumber: 4; SheetTotal: 4
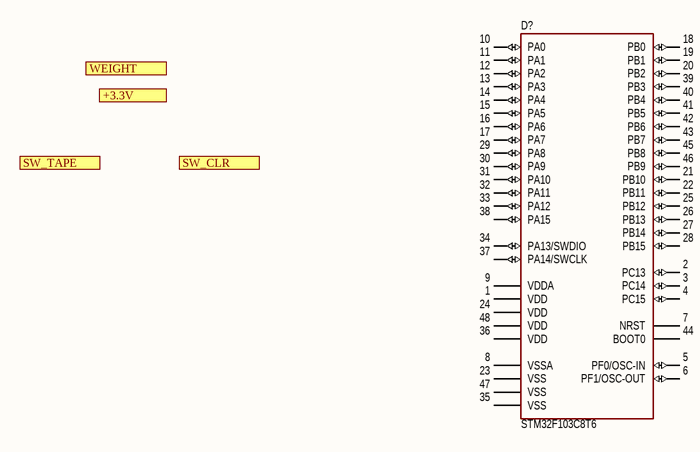
[diagram p3: Soft.SchDoc]

### Parts
D?  (no value)  [48-LQFP]

### Ports
+3.3V (out), SW_CLR (out), SW_TAPE (out), WEIGHT (out)

### Nets

Not connected (* = marked no-connect by the designer): D? 1(VDD) 2(PC13) 3(PC14) 4(PC15) 5(PF0/OSC-IN) 6(PF1/OSC-OUT) 7(NRST) 8(VSSA) 9(VDDA) 10(PA0) 11(PA1) 12(PA2) 13(PA3) 14(PA4) 15(PA5) 16(PA6) 17(PA7) 18(PB0) 19(PB1) 20(PB2) 21(PB10) 22(PB11) 23(VSS) 24(VDD) 25(PB12) 26(PB13) 27(PB14) 28(PB15) 29(PA8) 30(PA9) 31(PA10) 32(PA11) 33(PA12) 34(PA13/SWDIO) 35(VSS) 36(VDD) 37(PA14/SWCLK) 38(PA15) 39(PB3) 40(PB4) 41(PB5) 42(PB6) 43(PB7) 44(BOOT0) 45(PB8) 46(PB9) 47(VSS) 48(VDD)

### Library data of the parts
D? = STM32F103C8T6: Cortex-M0; Manufacturer: STMicroelectronics; ValueManufacturerPartNumber: IC microcontroller, 32-Bit, Cortex-M0, 48MHz, 64KB, 8KB, 2.4...3.6V, -40...+85°C, 48-LQFP; Supply: 2.4...3.6V; Speed: 48MHz; CoreSize: 32-Bit; MemoryROM: 64KB; MemoryRAM: 8KB; HelpURL: https://www.digikey.com/product-detail/en/stmicroelectronics/STM32F030C8T6/497-14043-ND/4357252; Package: 48-LQFP; ComponentType: IC microcontroller; Temperature: -40...+85°C; CoreProcessor: Cortex-M0; PartNumber: STM32F103C8T6

## Nets that join several sheets
GND: Base (41 pins), Hard (56 pins)
VCC: Base (9 pins), Hard (40 pins)
NetC16_2: Base (C16.2 R29.2 SB1.1), Hard (D5.5)
NetD5_10: Base (R30.2 SB2.1), Hard (D5.10)
NetD13_6: Base (D20.7 R48.1), Hard (D13.6)